# EasyEDA schematic SCH_Smart_Pill_Box.json
TITLE: Sheet_1; REV: 1.0; Date: 2023-11-18; Sheet: 1/1; Drawn By: ElectroEra Project Lab; Company: Your Company
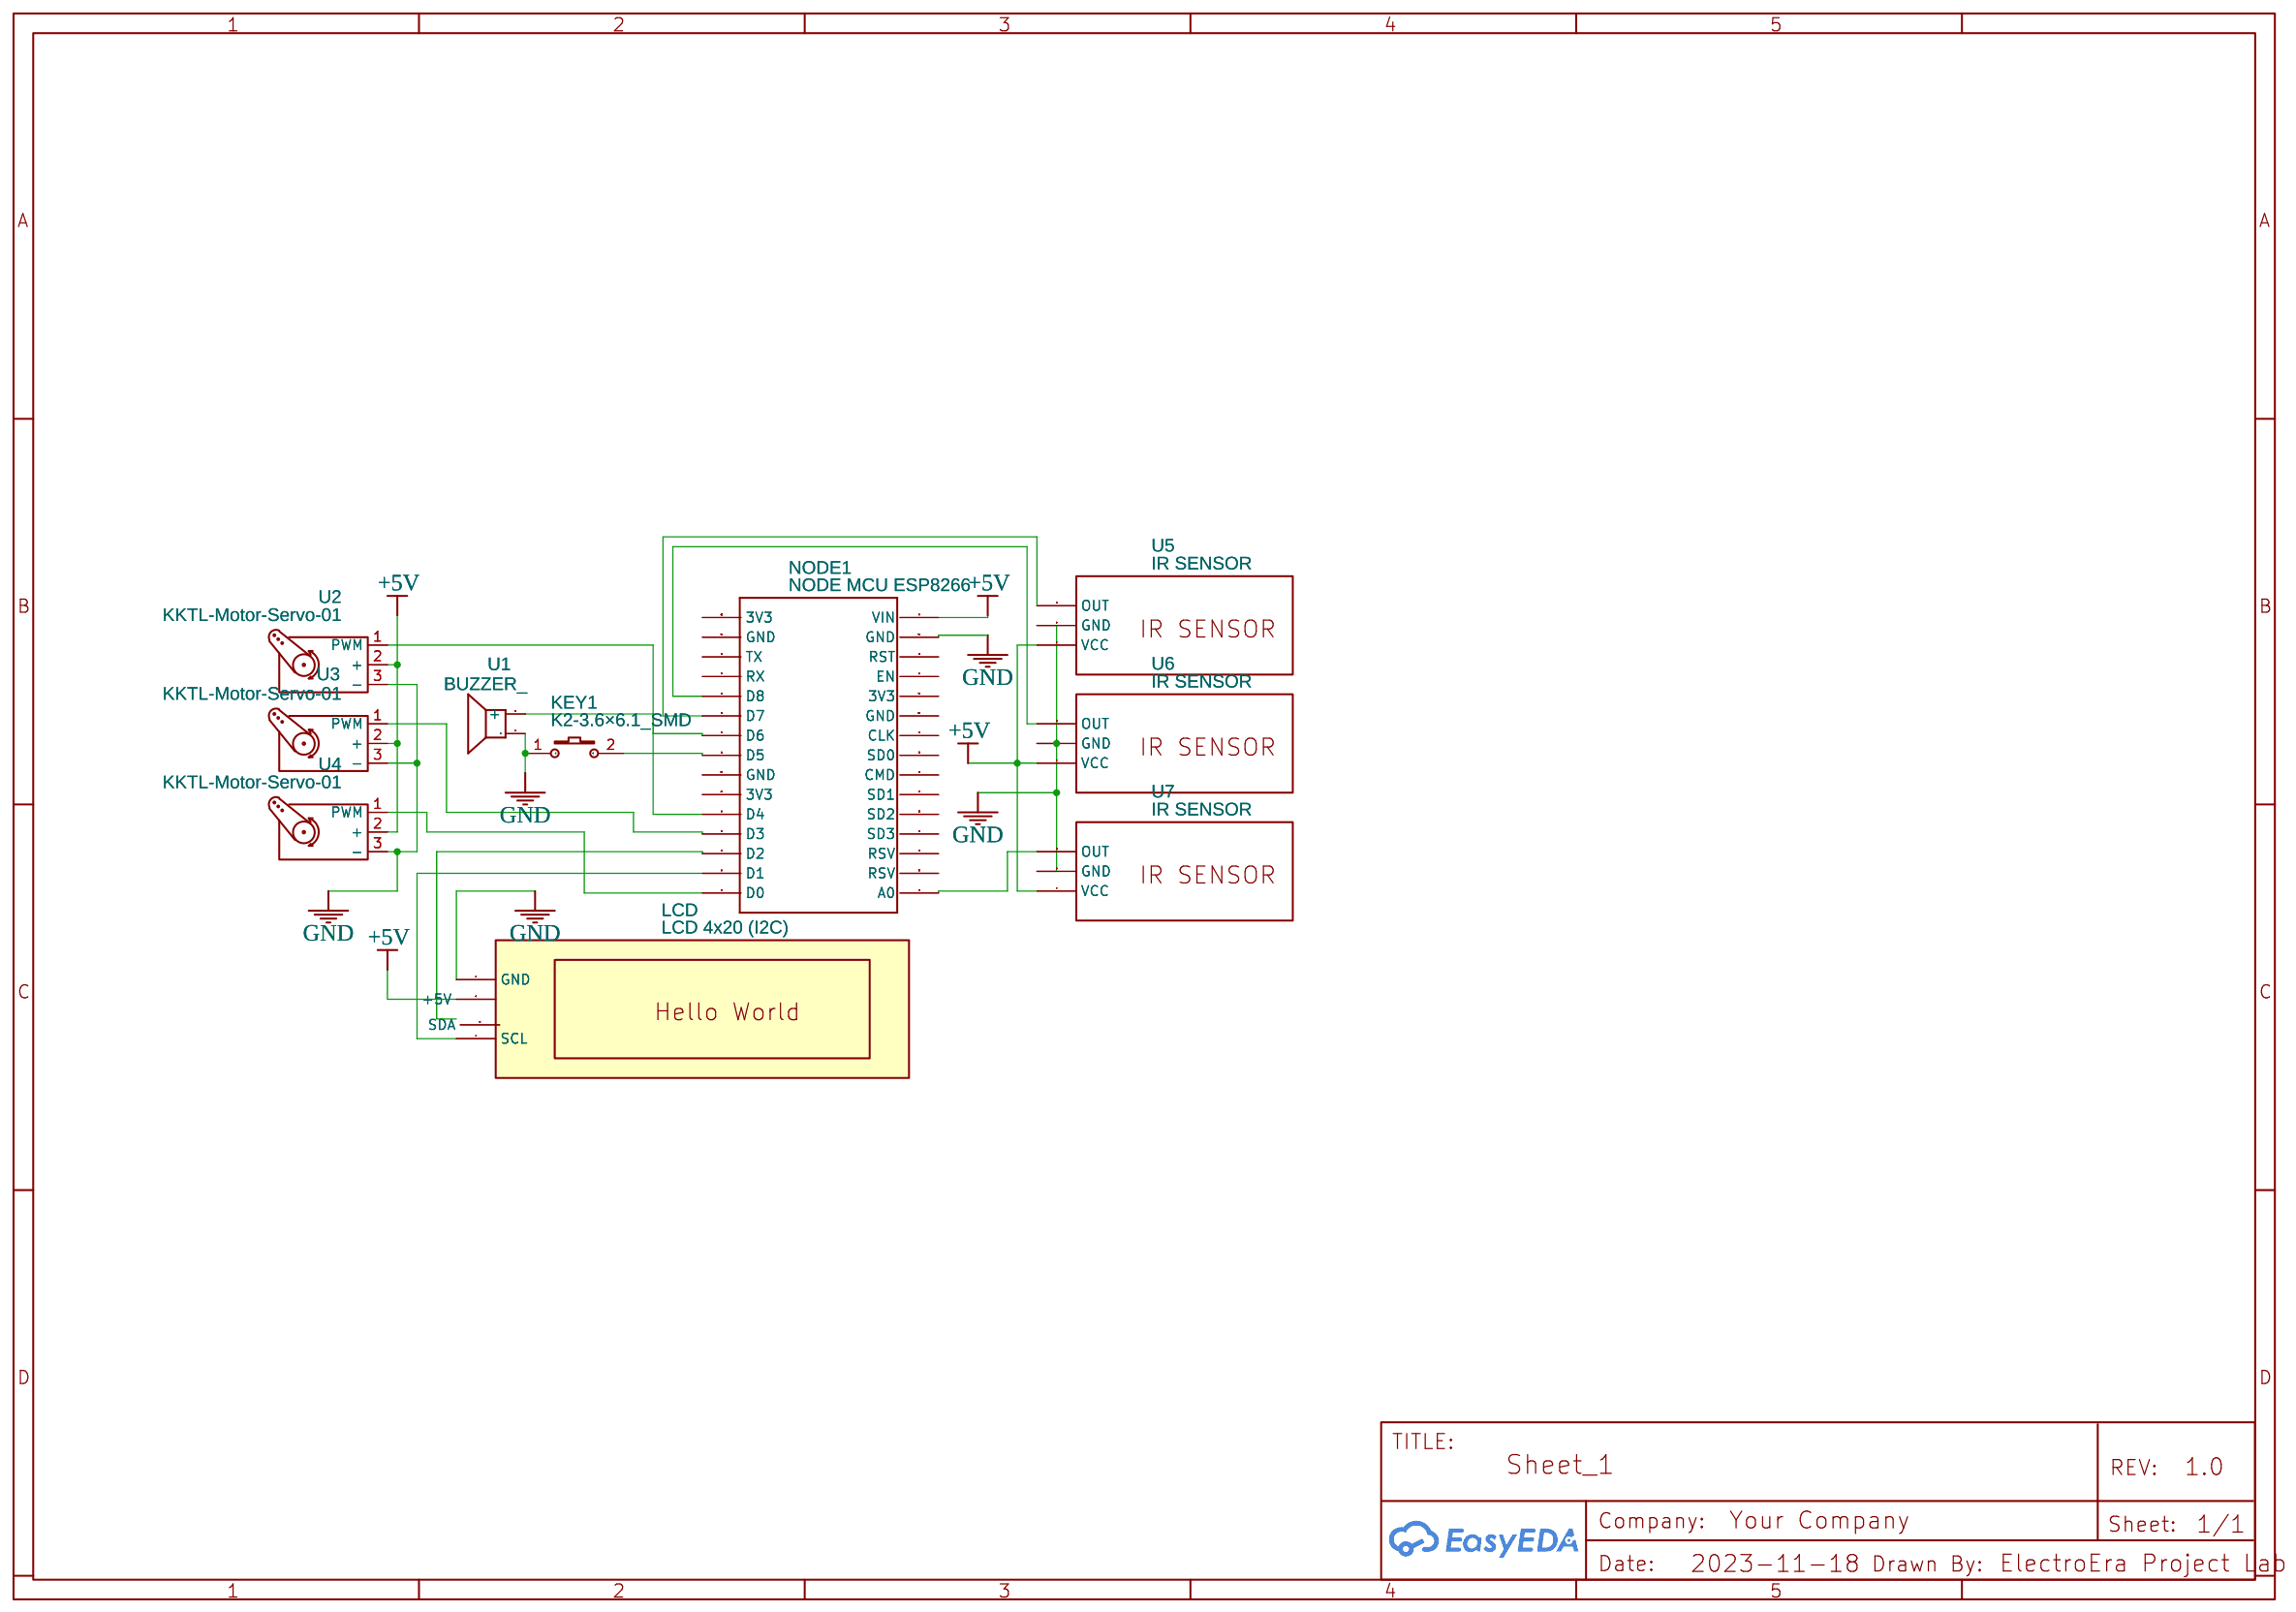
[diagram p0: schematic sheet]

## Parts
KEY1  K2-3.6×6.1_SMD  [KEY-SMD_2P-L6.2-W3.6-LS8.0]
LCD  LCD 4x20 (I2C)  [I2C LCD-20X4]
NODE1  NODE MCU ESP8266  [NODEMCU_ESP8266_NODEMCU_ESP8266]
U1  BUZZER_  [BUZ-SMD_BUZZER]
U2  KKTL-Motor-Servo-01  [KKTL-MOTOR-SERVO-01]
U3  KKTL-Motor-Servo-01  [KKTL-MOTOR-SERVO-01]
U4  KKTL-Motor-Servo-01  [KKTL-MOTOR-SERVO-01]
U5  IR SENSOR  [MH-SENSOR-SERIES-LINE-SENSOR]
U6  IR SENSOR  [MH-SENSOR-SERIES-LINE-SENSOR]
U7  IR SENSOR  [MH-SENSOR-SERIES-LINE-SENSOR]

## Library data of the parts
KEY1 = K2-3.6×6.1_SMD: Supplier Part: C118141; Supplier: LCSC; Manufacturer Part: K2-1107ST-A4SW-06; Contributor: LCEDA_Lib; 制造商: 韩国韩荣
LCD = LCD 4x20 (I2C): Contributor: banjerdmaising3; sourceId: SslDVP7pH
NODE1 = NODE MCU ESP8266: Contributor: nikolai0
U1 = BUZZER_C9900021864: Contributor: lcsc; Supplier: LCSC; Supplier Part: C9900021864; Manufacturer: null; Manufacturer Part: BUZZER; JLCPCB Part Class: Extended Part; link: https://lcsc.com/eda_search?q=C9900021864&%26type=1&ref=editor
U2-U4 = KKTL-Motor-Servo-01: Contributor: jolia51809102
U5-U7 = MH-Sensor-Series Line Sensor: Contributor: gameaja147

## Nets
+5V: LCD.2(+5V) NODE1.VIN U2.2(+) U3.2(+) U4.2(+) U5.4(VCC) U6.4(VCC) U7.4(VCC)
GND: KEY1.1 LCD.1(GND) NODE1.GND@4(GND) U1.1 U2.3(-) U3.3(-) U4.3(-) U5.3(GND) U6.3(GND) U7.3(GND)
Net-(KEY1-2): KEY1.2 NODE1.D5
Net-(LCD-3): LCD.3(SDA) NODE1.D2
Net-(LCD-4): LCD.4(SCL) NODE1.D1
Net-(NODE1-A0): NODE1.A0 U7.2(OUT)
Net-(NODE1-D0): NODE1.D0 U4.1(PWM)
Net-(NODE1-D3): NODE1.D3 U3.1(PWM)
Net-(NODE1-D4): NODE1.D4 U2.1(PWM)
Net-(NODE1-D6): NODE1.D6 U1.2(+)
Net-(NODE1-D7): NODE1.D7 U5.2(OUT)
Net-(NODE1-D8): NODE1.D8 U6.2(OUT)

Not connected (* = marked no-connect by the designer): NODE1 3V3@1(3V3) 3V3@2(3V3) 3V3@3(3V3) CLK CMD EN GND@1(GND) GND@2(GND) GND@3(GND) RST RSV1(RSV) RSV2(RSV) RX SD1 SD2 SD3 SDO(SD0) TX
